# EAGLE design Rectifi-Presicion (EAGLE 7.2.0)
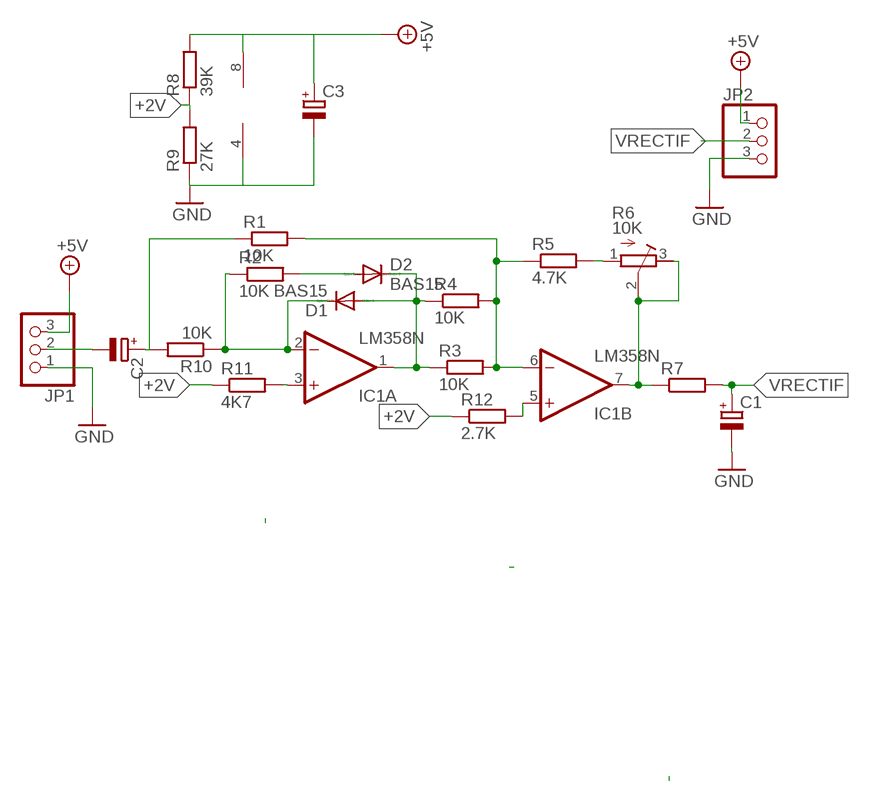
[diagram p0: schematic, sheet 1]

## Parts
C1  CPOL-EUE2.5-5  [E2,5-5]
C2  CPOL-EUE2.5-5  [E2,5-5]
C3  CPOL-EUE2.5-6  [E2,5-6]
D1  BAS15  [DO34-7]
D2  BAS15  [DO34-7]
IC1  LM358N  [DIL08]
JP1  PINHD-1X3  [1X03]
JP2  PINHD-1X3  [1X03]
R1  10K  R-EU_0207/7  [0207/7]
R2  10K  R-EU_0207/7  [0207/7]
R3  10K  R-EU_0207/7  [0207/7]
R4  10K  R-EU_0207/7  [0207/7]
R5  4.7K  R-EU_0207/7  [0207/7]
R6  10K  R-TRIMM64W  [RTRIM64W]
R7  R-EU_0207/7  [0207/7]
R8  39K  R-EU_0207/7  [0207/7]
R9  27K  R-EU_0207/7  [0207/7]
R10  10K  R-EU_0207/7  [0207/7]
R11  4K7  R-EU_0207/7  [0207/7]
R12  2.7K  R-EU_0207/7  [0207/7]

## Nets
+2V: R8.1 R9.2 R11.1 R12.1
+5V: C3.+ IC1.8(P:V+) JP1.3 JP2.1 R8.2
GND: C1.- C3.- IC1.4(P:V-) JP1.1 JP2.3 R9.1
N$1: D1.A D2.C IC1.1(A:OUT) R3.1 R4.1
N$2: C2.+ R1.1 R10.2
N$3: R5.2 R6.1(A)
N$4: D2.A R2.2
N$6: IC1.6(B:-IN) R1.2 R3.2 R4.2 R5.1
N$7: D1.C IC1.2(A:-IN) R2.1 R10.1
N$8: IC1.7(B:OUT) R6.2(S) R6.3(E) R7.1
N$10: C2.- JP1.2
N$15: IC1.5(B:+IN) R12.2
VPOL: IC1.3(A:+IN) R11.2
VRECTIF: C1.+ JP2.2 R7.2

## Library data of the parts
C1-C3 = rcl:CPOL-EU: POLARIZED CAPACITOR, European symbol
D1 D2 = diode:BAS15: DIODE high speed
IC1 = linear:LM358: OP AMP also LM158; LM258; LM2904 Source: http://cache.national.com/ds/LM/LM158.pdf
JP1 JP2 = pinhead:PINHD-1X3: PIN HEADER
R1-R5 R7-R12 = resistor:R-EU_: RESISTOR, European symbol
R6 = resistor:R-TRIMM: Trimm resistor

## Board
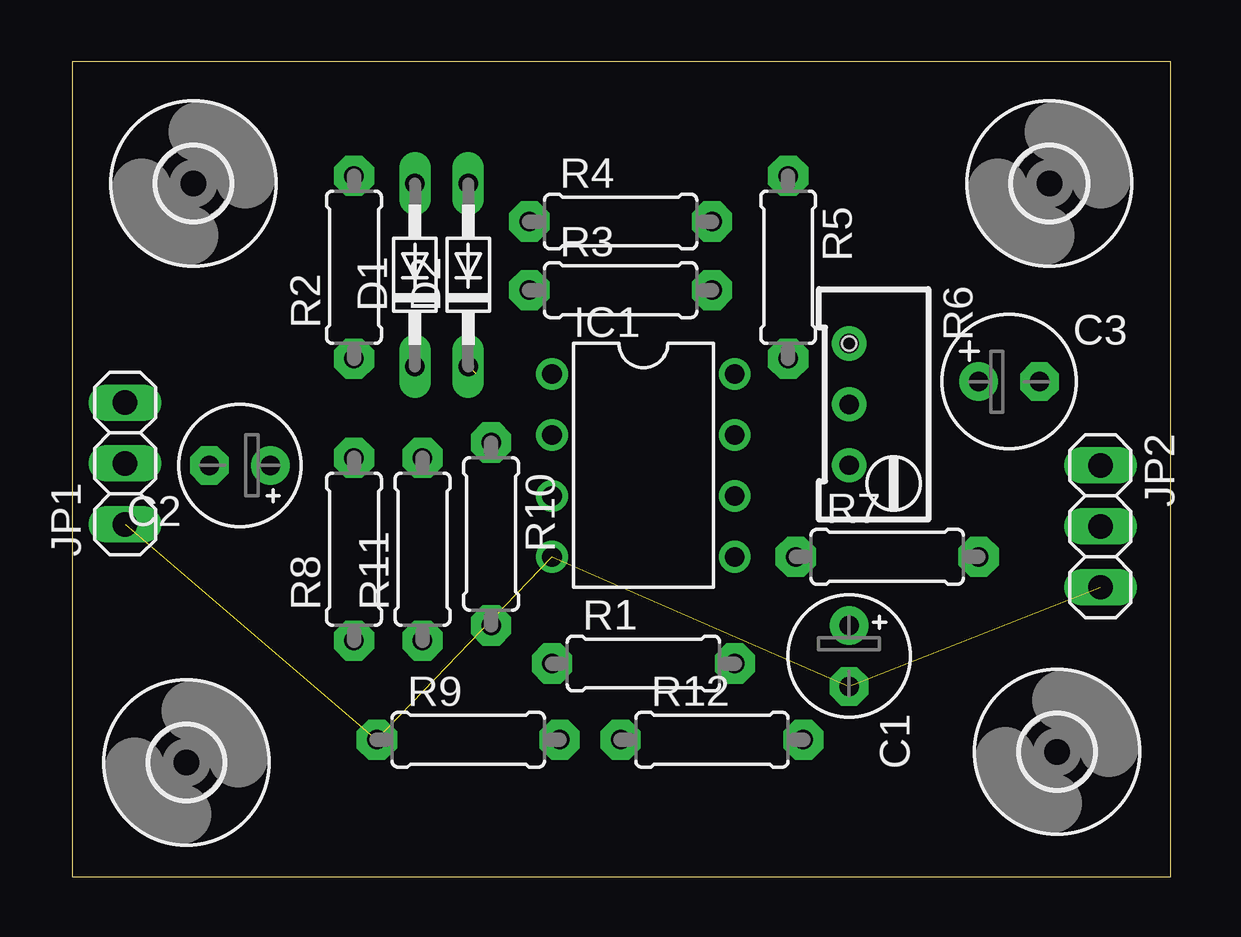
[diagram p1: board, top side]
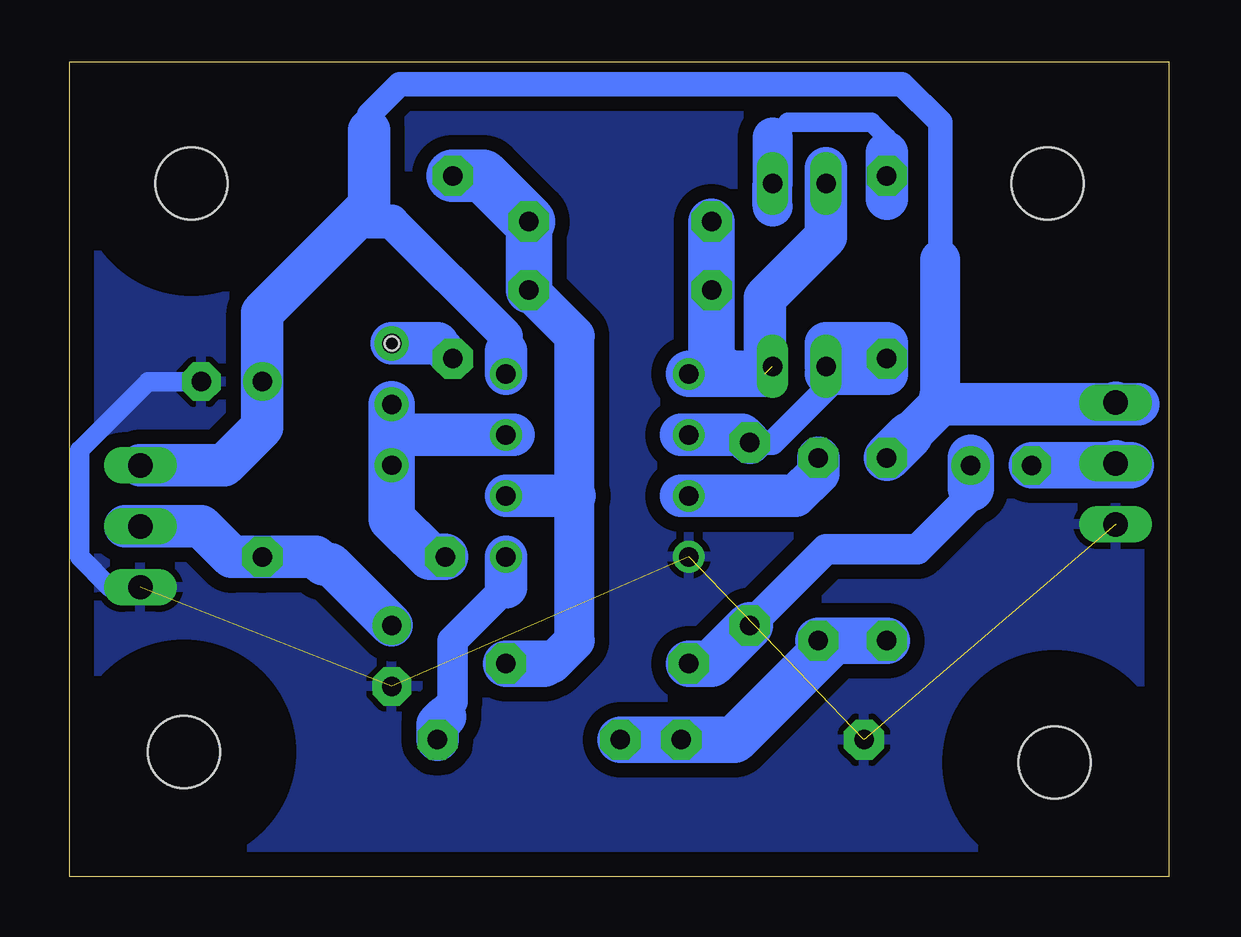
[diagram p2: board, bottom side, seen from below]

Size 45.8 x 33.96 mm. Coordinates in mm from the lower left corner, seen from the top.
Outline: 0,0 45.8,0 45.8,33.96 0,33.96 0,0
Copper layers (1*16): Top 0.035mm / dielectric 1.5mm / Bottom 0.035mm
Design rules "default": minimum track width 10mil, minimum drill 24mil, track to track 8mil, track to pad 8mil, pad to pad 8mil, via to via 8mil, smd to smd 8mil, copper to edge 40mil, drill to drill 8mil, minimum pad ring 10mil, minimum via ring 8mil, stop-mask expansion 4mil, vias tented up to drill 0mil, thermal gap 10mil

### Footprints (pad centres in the part's own frame; a part is rotated, then mirrored left to right if it is on the bottom)
E2,5-5 = drill 0.813 pad 1.6: + -1.27,0 | drill 0.813 pad 1.6 octagon: - 1.27,0
E2,5-6 = drill 0.813 pad 1.6: + -1.27,0 | drill 0.813 pad 1.6 octagon: - 1.27,0
DO34-7 = drill 0.813 long: A 3.81,0; C -3.81,0
DIL08 = drill 0.813 pad 1.27: 1 -3.81,-3.81; 2 -1.27,-3.81; 3 1.27,-3.81; 4 3.81,-3.81; 5 3.81,3.81; 6 1.27,3.81; 7 -1.27,3.81; 8 -3.81,3.81
1X03 = drill 1.016 long: 1 -2.54,0; 2 0,0; 3 2.54,0
0207/7 = drill 0.813 pad 1.676 octagon: 1 -3.81,0; 2 3.81,0
RTRIM64W = drill 0.8 pad 1.422: 1 1.27,-2.54; 2 1.27,0; 3 1.27,2.54 | hole 0.6: 1.27,-2.54
3,0 = hole 3: 0,0

### Placement (x,y rotation side)
C1  32.38,9.21 270 top
C2  6.99,17.14 180 top
C3  39.05,20.64 0 top
D1  14.29,25.08 90 top
D2  16.51,25.08 90 top
IC1  23.81,17.14 270 top
JP1  2.21,17.23 90 top
JP2  42.86,14.61 270 top
R1  23.81,8.89 0 top
R2  11.75,25.4 90 top
R3  22.86,24.45 0 top
R4  22.86,27.3 0 top
R5  29.84,25.4 270 top
R6  33.66,19.68 180 top
R7  33.97,13.34 0 top
R8  11.75,13.65 90 top
R9  16.51,5.71 0 top
R10  17.46,14.29 270 top
R11  14.61,13.65 90 top
R12  26.67,5.71 0 top
U$1  [3,0]  40.73,28.89 0 top
U$2  [3,0]  4.76,4.76 0 top
U$3  [3,0]  5.05,28.89 0 top
U$4  [3,0]  41.05,5.21 0 top

### Tracks (layer width: path | path; a pad name or v marks a point on that pad's centre or on a via)
+2V
  Bottom 1.93: R11.1 13.97,9.84 | 13.97,9.84 R8.1 | R12.1 R9.2 18.1,5.71 13.97,9.84
+5V
  Bottom 1.016: 33.34,31.11 33.34,31.75 32.07,33.02 11.11,33.02 9.53,31.43 9.53,25.08
  Bottom 1.422: 27.62,21.91 27.62,22.54 32.38,27.3 33.34,27.3 33.66,27.62
  Bottom 1.676: 9.53,20 9.53,25.08 9.53,25.72
  Bottom 1.778: JP2.1 39.37,17.14 37.78,18.73 C3.+ 37.78,23.5 33.66,27.62 33.34,27.94 33.34,31.11 | 10.79,18.41 9.53,19.68 | 9.53,19.68 2.13,19.68 | 1.27,19.68 2.13,19.68 | 2.13,19.68 JP1.3 | 9.53,19.68 9.53,20 | IC1.8 27.62,21.91
  Bottom 1.93: R8.2 10.79,18.41
GND  (4 unrouted)
  Bottom 0.813: JP2.3 44.13,12.06 45.4,13.34 45.4,17.78 42.55,20.64 C3.-
  pour Bottom (isolate 0.61): 0,33.97 45.72,33.97 45.72,24.45 45.72,0 19.05,0 0,0 0,8.57 0,24.45
N$1  (1 unrouted)
  Bottom 1.778: 14.29,29.53 D1.A 14.29,26.67 16.83,24.13 16.83,20.95
  Bottom 1.93: IC1.1 18.41,20.95 | 18.41,20.95 16.83,20.95 | 18.41,20.95 19.05,21.59 R3.1 R4.1
N$2
  Bottom 1.27: 8.26,16.19 8.26,15.88 10.48,13.65 14.29,13.65 R10.2
  Bottom 1.93: R1.1 19.05,8.89 R10.2 | 8.26,17.46 C2.+ 8.26,16.19
N$3
  Bottom 1.676: R5.2 30.48,22.23
  Bottom 1.778: 30.48,22.23 R6.1
N$4
  Bottom 0.813: 11.75,30.16 11.75,30.8 12.38,31.43 15.88,31.43 16.51,30.8
  Bottom 1.676: 16.51,30.8 D2.A 16.51,27.94
  Bottom 1.778: 11.75,28.26 R2.2 11.75,30.16
N$6
  Bottom 1.676: 26.04,8.89 25.72,8.89 24.77,9.84 24.77,15.88 24.77,22.54 R3.2
  Bottom 1.778: IC1.6 24.77,15.88
  Bottom 1.93: R3.2 R4.2 | R1.2 26.04,8.89
  Bottom 2.184: R5.1 28.57,29.21 R4.2
N$7
  Bottom 1.016: R10.1 16.51,18.1 13.65,20.95
  Bottom 1.778: D1.C 14.29,22.23 11.75,22.23 R2.1 | R2.1 11.75,20.95 12.38,20.95 | 14.29,20.95 13.65,20.95 12.38,20.95 | 12.38,20.95 R2.1 | 20.32,18.41 IC1.2 17.78,18.41 R10.1
N$8
  Bottom 1.778: 27.3,18.41 IC1.7 32.38,18.41
  Bottom 1.93: R6.2 32.38,18.41 R6.3 32.38,14.92 30.8,13.34 R7.1
N$10
  Bottom 1.93: C2.- 2.13,17.14 | 1.59,17.14 2.13,17.14 | 2.13,17.14 JP1.2
N$15
  Bottom 1.27: 30.16,6.67 30.16,6.99 29.84,7.3 29.84,9.84 27.62,12.06
  Bottom 1.778: R12.2 30.48,6.35 30.16,6.67 | 27.62,12.06 IC1.5
VPOL
  Bottom 1.778: 20.32,15.88 IC1.3 15.56,15.88 14.61,16.83 R11.2
VRECTIF
  Bottom 1.778: C1.+ 34.92,13.02 35.24,13.02 35.56,13.34 R7.2 39.05,13.34 40.32,14.61 JP2.2 43.5,14.61